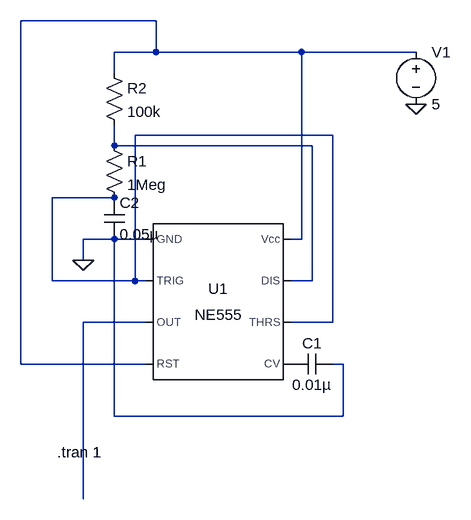
[diagram p0: schematic Draft20.asc]
Draft20.asc, the LTspice schematic file:
Version 4
SHEET 1 1060 692
WIRE 352 -144 144 -144
WIRE 352 -96 352 -144
WIRE 352 -96 288 -96
WIRE 576 -96 352 -96
WIRE 752 -96 576 -96
WIRE 288 -64 288 -96
WIRE 624 32 320 32
WIRE 288 48 288 16
WIRE 592 48 288 48
WIRE 288 128 192 128
WIRE 288 192 240 192
WIRE 336 192 288 192
WIRE 576 192 576 -96
WIRE 576 192 560 192
WIRE 240 224 240 192
WIRE 192 256 192 128
WIRE 320 256 320 32
WIRE 320 256 192 256
WIRE 336 256 320 256
WIRE 592 256 592 48
WIRE 592 256 560 256
WIRE 336 320 240 320
WIRE 624 320 624 32
WIRE 624 320 560 320
WIRE 144 384 144 -144
WIRE 336 384 144 384
WIRE 640 384 624 384
WIRE 288 464 288 192
WIRE 640 464 640 384
WIRE 640 464 288 464
WIRE 240 592 240 320
FLAG 240 224 0
FLAG 752 -16 0
SYMBOL Misc/NE555 448 288 R0
SYMATTR InstName U1
SYMBOL cap 624 368 R90
WINDOW 0 0 32 VBottom 2
WINDOW 3 32 32 VTop 2
SYMATTR InstName C1
SYMATTR Value 0.01µ
SYMBOL cap 272 128 R0
SYMATTR InstName C2
SYMATTR Value 0.05µ
SYMBOL res 272 32 R0
SYMATTR InstName R1
SYMATTR Value 1Meg
SYMBOL res 272 -80 R0
SYMATTR InstName R2
SYMATTR Value 100k
SYMBOL voltage 752 -112 R0
SYMATTR InstName V1
SYMATTR Value 5
TEXT 200 520 Left 2 !.tran 1

The netlist it stands for:
* Draft20.asc
XU1 0 N002 N004 N001 P001 N002 N003 N001 NE555  ; pins GND TRIG OUT RST CV THRS DIS Vcc
C1 0 P001 0.01µ
C2 N002 0 0.05µ
R1 N003 N002 1Meg
R2 N001 N003 100k
V1 N001 0 5
.tran 1
.lib NE555.sub
.backanno
.end